# Altium schematic sheet core_pwr.SchDoc
size A4; SheetNumber: 1; SheetTotal: 5
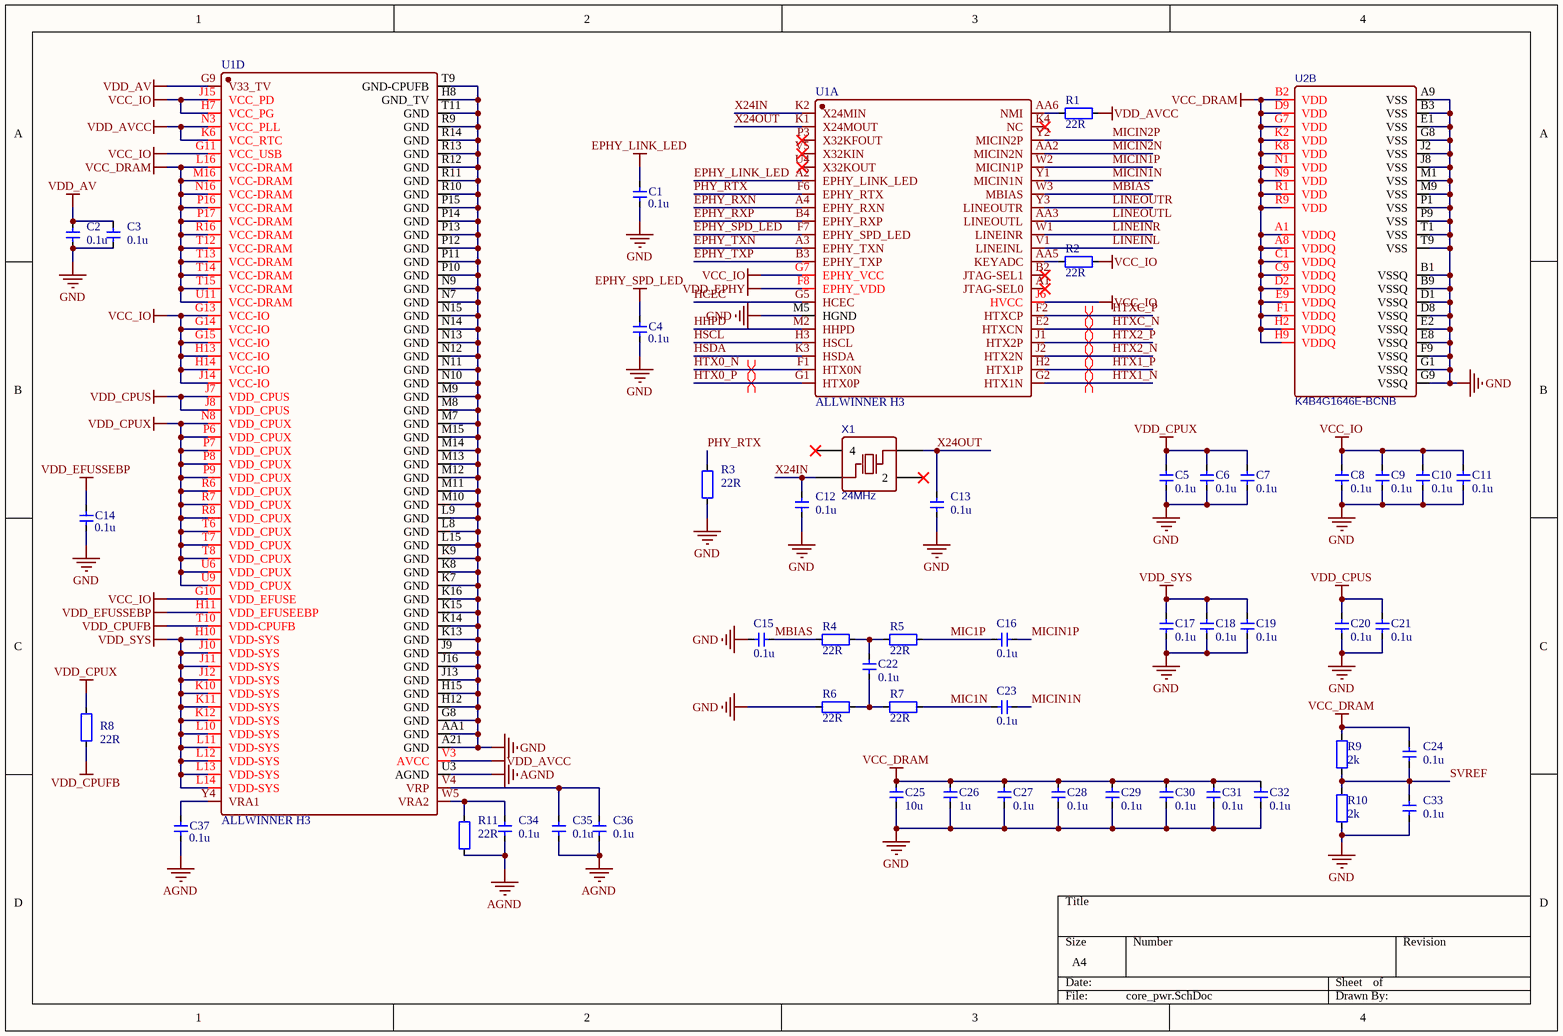
[diagram p0: core_pwr.SchDoc]

## Parts
C1  value 0.1u  [C0402]  (hidden comment: CAP-0402)
C2  value 0.1u  [C0402]  (hidden comment: CAP-0402)
C3  value 0.1u  [C0402]  (hidden comment: CAP-0402)
C4  value 0.1u  [C0402]  (hidden comment: CAP-0402)
C5  value 0.1u  [C0402]  (hidden comment: CAP-0402)
C6  value 0.1u  [C0402]  (hidden comment: CAP-0402)
C7  value 0.1u  [C0402]  (hidden comment: CAP-0402)
C8  value 0.1u  [C0402]  (hidden comment: CAP-0402)
C9  value 0.1u  [C0402]  (hidden comment: CAP-0402)
C10  value 0.1u  [C0402]  (hidden comment: CAP-0402)
C11  value 0.1u  [C0402]  (hidden comment: CAP-0402)
C12  value 0.1u  [C0402]  (hidden comment: CAP-0402)
C13  value 0.1u  [C0402]  (hidden comment: CAP-0402)
C14  value 0.1u  [C0402]  (hidden comment: CAP-0402)
C15  value 0.1u  [C0402]  (hidden comment: CAP-0402)
C16  value 0.1u  [C0402]  (hidden comment: CAP-0402)
C17  value 0.1u  [C0402]  (hidden comment: CAP-0402)
C18  value 0.1u  [C0402]  (hidden comment: CAP-0402)
C19  value 0.1u  [C0402]  (hidden comment: CAP-0402)
C20  value 0.1u  [C0402]  (hidden comment: CAP-0402)
C21  value 0.1u  [C0402]  (hidden comment: CAP-0402)
C22  value 0.1u  [C0402]  (hidden comment: CAP-0402)
C23  value 0.1u  [C0402]  (hidden comment: CAP-0402)
C24  value 0.1u  [C0402]  (hidden comment: CAP-0402)
C25  value 10u  [C0402]  (hidden comment: CAP-0402)
C26  value 1u  [C0402]  (hidden comment: CAP-0402)
C27  value 0.1u  [C0402]  (hidden comment: CAP-0402)
C28  value 0.1u  [C0402]  (hidden comment: CAP-0402)
C29  value 0.1u  [C0402]  (hidden comment: CAP-0402)
C30  value 0.1u  [C0402]  (hidden comment: CAP-0402)
C31  value 0.1u  [C0402]  (hidden comment: CAP-0402)
C32  value 0.1u  [C0402]  (hidden comment: CAP-0402)
C33  value 0.1u  [C0402]  (hidden comment: CAP-0402)
C34  value 0.1u  [C0402]  (hidden comment: CAP-0402)
C35  value 0.1u  [C0402]  (hidden comment: CAP-0402)
C36  value 0.1u  [C0402]  (hidden comment: CAP-0402)
C37  value 0.1u  [C0402]  (hidden comment: CAP-0402)
R1  value 22R  [R0402]  (hidden comment: RES-0402)
R2  value 22R  [R0402]  (hidden comment: RES-0402)
R3  value 22R  [R0402]  (hidden comment: RES-0402)
R4  value 22R  [R0402]  (hidden comment: RES-0402)
R5  value 22R  [R0402]  (hidden comment: RES-0402)
R6  value 22R  [R0402]  (hidden comment: RES-0402)
R7  value 22R  [R0402]  (hidden comment: RES-0402)
R8  value 22R  [R0402]  (hidden comment: RES-0402)
R9  value 2k  [R0402]  (hidden comment: RES-0402)
R10  value 2k  [R0402]  (hidden comment: RES-0402)
R11  value 22R  [R0402]  (hidden comment: RES-0402)
U1  ALLWINNER H3  [BGA-347_L14.0-W14.0-R21-C21-P0.65-TL]  (parts A,D of 4)
U2  K4B4G1646E-BCNB  [FBGA-96_L13.5-W7.5-R16-C6-P0.80-TL]  (part B of 2)
X1  24MHz  [OSC-SMD_4P-L3.2-W2.5-BL]

## Nets
AGND: C34.1 C35.1 C36.1 C37.1 R11.1 U1.U3(AGND)
EPHY_LINK_LED: C1.2 U1.A2(EPHY_LINK_LED)
EPHY_SPD_LED: C4.2 U1.F7(EPHY_SPD_LED)
GND: C1.1 C2.1 C3.1 C4.1 C5.2 C6.2 C7.2 C8.2 C9.2 C10.2 C11.2 C12.1 C13.1 C14.1 C15.2 C17.2 C18.2 C19.2 C20.2 C21.2 C25.2 C26.2 C27.2 C28.2 C29.2 C30.2 C31.2 C32.2 C33.1 R3.1 R6.2 R10.2 U1.A21(GND) U1.AA1(GND) U1.G8(GND) U1.H8(GND_TV) U1.H12(GND) U1.H15(GND) U1.J9(GND) U1.J13(GND) U1.J16(GND) U1.K7(GND) U1.K8(GND) U1.K9(GND) U1.K13(GND) U1.K14(GND) U1.K15(GND) U1.K16(GND) U1.L8(GND) U1.L9(GND) U1.L15(GND) U1.M5(HGND) U1.M7(GND) U1.M8(GND) U1.M9(GND) U1.M10(GND) U1.M11(GND) U1.M12(GND) U1.M13(GND) U1.M14(GND) U1.M15(GND) U1.N7(GND) U1.N9(GND) U1.N10(GND) U1.N11(GND) U1.N12(GND) U1.N13(GND) U1.N14(GND) U1.N15(GND) U1.P10(GND) U1.P11(GND) U1.P12(GND) U1.P13(GND) U1.P14(GND) U1.P15(GND) U1.R9(GND) U1.R10(GND) U1.R11(GND) U1.R12(GND) U1.R13(GND) U1.R14(GND) U1.T9(GND-CPUFB) U1.T11(GND) U2.A9(VSS) U2.B1(VSSQ) U2.B3(VSS) U2.B9(VSSQ) U2.D1(VSSQ) U2.D8(VSSQ) U2.E1(VSS) U2.E2(VSSQ) U2.E8(VSSQ) U2.F9(VSSQ) U2.G1(VSSQ) U2.G8(VSS) U2.G9(VSSQ) U2.J2(VSS) U2.J8(VSS) U2.M1(VSS) U2.M9(VSS) U2.P1(VSS) U2.P9(VSS) U2.T1(VSS) U2.T9(VSS)
VCC_DRAM: C24.2 C25.1 C26.1 C27.1 C28.1 C29.1 C30.1 C31.1 C32.1 R9.1 U1.L16(VCC-DRAM) U1.M16(VCC-DRAM) U1.N16(VCC-DRAM) U1.P16(VCC-DRAM) U1.P17(VCC-DRAM) U1.R16(VCC-DRAM) U1.T12(VCC-DRAM) U1.T13(VCC-DRAM) U1.T14(VCC-DRAM) U1.T15(VCC-DRAM) U1.U11(VCC-DRAM) U2.A1(VDDQ) U2.A8(VDDQ) U2.B2(VDD) U2.C1(VDDQ) U2.C9(VDDQ) U2.D2(VDDQ) U2.D9(VDD) U2.E9(VDDQ) U2.F1(VDDQ) U2.G7(VDD) U2.H2(VDDQ) U2.H9(VDDQ) U2.K2(VDD) U2.K8(VDD) U2.N1(VDD) U2.N9(VDD) U2.R1(VDD) U2.R9(VDD)
VCC_IO: C8.1 C9.1 C10.1 C11.1 R2.1 U1.G7(EPHY_VCC) U1.G10(VDD_EFUSE) U1.G11(VCC_USB) U1.G13(VCC-IO) U1.G14(VCC-IO) U1.G15(VCC-IO) U1.H7(VCC_PG) U1.H13(VCC-IO) U1.H14(VCC-IO) U1.J6(HVCC) U1.J14(VCC-IO) U1.J15(VCC_PD)
VDD_AV: C2.2 C3.2 U1.G9(V33_TV)
VDD_AVCC: R1.1 U1.K6(VCC_RTC) U1.N3(VCC_PLL) U1.V3(AVCC)
VDD_CPUFB: R8.1 U1.T10(VDD-CPUFB)
VDD_CPUS: C20.1 C21.1 U1.J7(VDD_CPUS) U1.J8(VDD_CPUS)
VDD_CPUX: C5.1 C6.1 C7.1 R8.2 U1.N8(VDD_CPUX) U1.P6(VDD_CPUX) U1.P7(VDD_CPUX) U1.P8(VDD_CPUX) U1.P9(VDD_CPUX) U1.R6(VDD_CPUX) U1.R7(VDD_CPUX) U1.R8(VDD_CPUX) U1.T6(VDD_CPUX) U1.T7(VDD_CPUX) U1.T8(VDD_CPUX) U1.U6(VDD_CPUX) U1.U9(VDD_CPUX)
VDD_EFUSSEBP: C14.2 U1.H11(VDD_EFUSEEBP)
VDD_EPHY: U1.F8(EPHY_VDD)
VDD_SYS: C17.1 C18.1 C19.1 U1.H10(VDD-SYS) U1.J10(VDD-SYS) U1.J11(VDD-SYS) U1.J12(VDD-SYS) U1.K10(VDD-SYS) U1.K11(VDD-SYS) U1.K12(VDD-SYS) U1.L10(VDD-SYS) U1.L11(VDD-SYS) U1.L12(VDD-SYS) U1.L13(VDD-SYS) U1.L14(VDD-SYS)
EPHY_RXN: U1.A4(EPHY_RXN)
EPHY_RXP: U1.B4(EPHY_RXP)
EPHY_TXN: U1.A3(EPHY_TXN)
EPHY_TXP: U1.B3(EPHY_TXP)
HCEC: U1.G5(HCEC)
HHPD: U1.M2(HHPD)
HSCL: U1.H3(HSCL)
HSDA: U1.K3(HSDA)
HTX0_N: U1.F1(HTX0N)
HTX0_P: U1.G1(HTX0P)
HTX1_N: U1.G2(HTX1N)
HTX1_P: U1.H2(HTX1P)
HTX2_N: U1.J2(HTX2N)
HTX2_P: U1.J1(HTX2P)
HTXC_N: U1.E2(HTXCN)
HTXC_P: U1.F2(HTXCP)
LINEINL: U1.V1(LINEINL)
LINEINR: U1.W1(LINEINR)
LINEOUTL: U1.AA3(LINEOUTL)
LINEOUTR: U1.Y3(LINEOUTR)
MBIAS: C15.1 R4.2 U1.W3(MBIAS)
MIC1N: C23.1 R7.2
MIC1P: C16.2 R5.1
MICIN1N: C23.2 U1.Y1(MICIN1N)
MICIN1P: C16.1 U1.W2(MICIN1P)
MICIN2N: U1.AA2(MICIN2N)
MICIN2P: U1.Y2(MICIN2P)
PHY_RTX: R3.2 U1.F6(EPHY_RTX)
SVREF: C24.1 C33.2 R9.2 R10.1
X24IN: C12.2 U1.K2(X24MIN) X1.1(OSC1)
X24OUT: C13.2 U1.K1(X24MOUT) X1.3(OSC2)
NetC22_1: C22.1 R4.1 R5.2
NetC22_2: C22.2 R6.1 R7.1
NetC34_2: C34.2 R11.2 U1.W5(VRA2)
NetC35_2: C35.2 C36.2 U1.V4(VRP)
NetC37_2: C37.2 U1.Y4(VRA1)
NetR1_2: R1.2 U1.AA6(NMI)
NetR2_2: R2.2 U1.AA5(KEYADC)

Not connected (* = marked no-connect by the designer): U1 A1(JTAG-SEL0)* B2(JTAG-SEL1)* K4(NC)* P3(X32KFOUT)* U4(X32KOUT)* V5(X32KIN)*; X1 2* 4*

## Layout directives
differential pair: HTX0_N, HTX0_P, HTX1_N, HTX1_P, HTX2_N, HTX2_P, HTXC_N, HTXC_P

## Library data of the parts
C1-C37 = CAP-0402: Capacitor
R1-R11 = RES-0402: Resistor
U2 = K4B4G1646E-BCNB: BOM_Manufacturer: SAMSUNG(三星半导体); Contributor: LCSC; BOM_Supplier Part: C2803248; BOM_Manufacturer Part: K4B4G1646E-BCNB; BOM_JLCPCB Part Class: Extended Part; spicePre: U; spiceSymbolName: K4B4G1646E-BCNB; BOM_Supplier: LCSC
X1 = 24MHz: BOM_Manufacturer: KDS; BOM_Manufacturer Part: DSX321G 24MHz; nameAlias: Frequency; Contributor: LCSC; BOM_Supplier: LCSC; BOM_Supplier Part: C93235; BOM_JLCPCB Part Class: Extended Part; spicePre: X; spiceSymbolName: DSX321G 24MHz